# Altium schematic sheet LPCB234 - BMS INTERFACE.SchDoc
size A3; Address1: Factory 10; Address2: 9-13 Dingley Avenue, Dandeong, VICTORIA 3175, AUSTRALIA; DocumentNumber: 4; Revision: 1; SheetNumber: 4; SheetTotal: 10; Lockie__PCB_SUB_ASSEMBLY: BMS Interface; Lockie__PCB_ASSEMBLY: Main; Lockie__LDL: LPCB234; Lockie__PCB_DESCRIPTION: RM4 Power Node
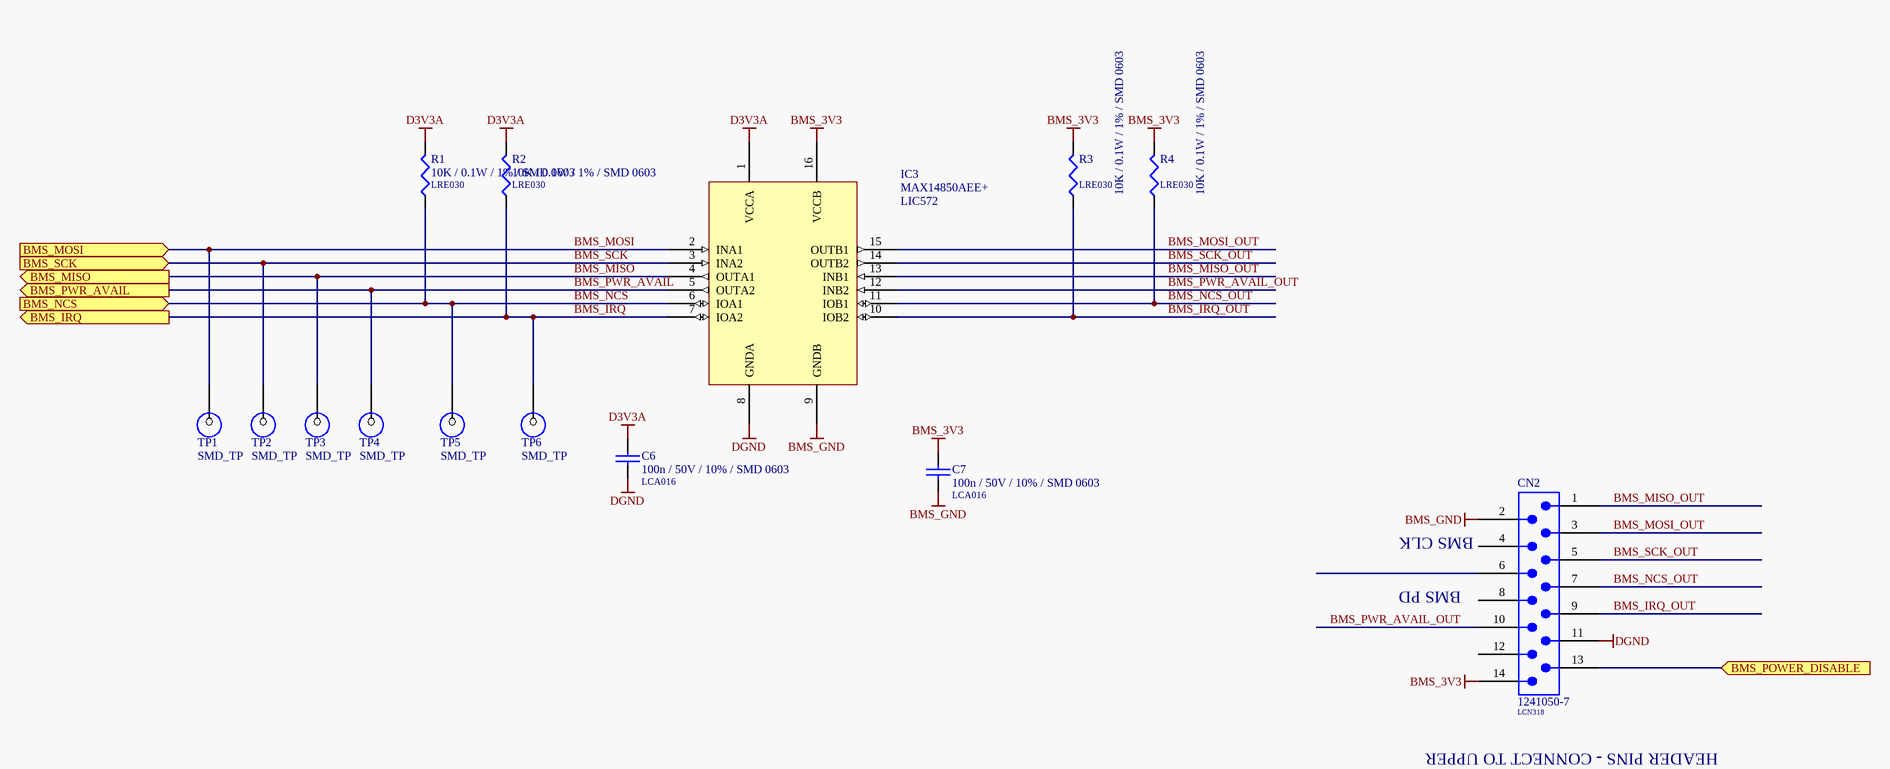
[diagram p0: LPCB234 - BMS INTERFACE.SchDoc]

## Parts
C6  100n / 50V / 10% / SMD 0603  LDL_NUMBER: LCA016  [LFP011__CC1608-0603-IPC7351_B]
C7  100n / 50V / 10% / SMD 0603  LDL_NUMBER: LCA016  [LFP011__CC1608-0603-IPC7351_B]
CN2  1241050-7  LDL_NUMBER: LCN318  [1241050-7]
IC3  MAX14850AEE+  LDL_NUMBER: LIC572  [LFP137__PW016]
R1  10K / 0.1W / 1% / SMD 0603  LDL_NUMBER: LRE030  [LFP020__CR1608-0603-IPC7351_B]
R2  10K / 0.1W / 1% / SMD 0603  LDL_NUMBER: LRE030  [LFP020__CR1608-0603-IPC7351_B]
R3  10K / 0.1W / 1% / SMD 0603  LDL_NUMBER: LRE030  [LFP020__CR1608-0603-IPC7351_B]
R4  10K / 0.1W / 1% / SMD 0603  LDL_NUMBER: LRE030  [LFP020__CR1608-0603-IPC7351_B]
TP1  SMD_TP  [SMD-TP]  (no BOM)
TP2  SMD_TP  [SMD-TP]  (no BOM)
TP3  SMD_TP  [SMD-TP]  (no BOM)
TP4  SMD_TP  [SMD-TP]  (no BOM)
TP5  SMD_TP  [SMD-TP]  (no BOM)
TP6  SMD_TP  [SMD-TP]  (no BOM)

## Ports
BMS_IRQ (out), BMS_MISO (out), BMS_MOSI (in), BMS_NCS (in), BMS_POWER_DISABLE (in), BMS_PWR_AVAIL (out), BMS_SCK (in)

## Nets
BMS_3V3: C7.1 CN2.14 IC3.16(VCCB) R3.2 R4.2
BMS_GND: C7.2 CN2.2 IC3.9(GNDB)
D3V3A: C6.1 IC3.1(VCCA) R1.2 R2.2
DGND: C6.2 CN2.11 IC3.8(GNDA)
BMS_IRQ: IC3.7(IOA2) R2.1 TP6.1 ; port BMS_IRQ
BMS_IRQ_OUT: CN2.9 IC3.10(IOB2) R3.1
BMS_MISO: IC3.4(OUTA1) TP3.1 ; port BMS_MISO
BMS_MISO_OUT: CN2.1 IC3.13(INB1)
BMS_MOSI: IC3.2(INA1) TP1.1 ; port BMS_MOSI
BMS_MOSI_OUT: CN2.3 IC3.15(OUTB1)
BMS_NCS: IC3.6(IOA1) R1.1 TP5.1 ; port BMS_NCS
BMS_NCS_OUT: CN2.7 IC3.11(IOB1) R4.1
BMS_POWER_DISABLE: CN2.13 ; port BMS_POWER_DISABLE
BMS_PWR_AVAIL: IC3.5(OUTA2) TP4.1 ; port BMS_PWR_AVAIL
BMS_PWR_AVAIL_OUT: CN2.10 IC3.12(INB2)
BMS_SCK: IC3.3(INA2) TP2.1 ; port BMS_SCK
BMS_SCK_OUT: CN2.5 IC3.14(OUTB2)

Not connected (* = marked no-connect by the designer): CN2 4 6 8 12

## Notes on the sheet
- BMS CLK
- BMS PD
- HEADER PINS - CONNECT TO UPPER
- PCB COMPONENT DESCRIPTION
- LDL NUMBER
- Assembly Details
- Size
- Drawing File Name
- Revision
- http://rloop.org
- Scale
- A3
- Sheet Details
- N.T.S
- Sheet:
- Of:

## Library data of the parts
C6 C7 = 100n / 50V / 10% / SMD 0603: Capacitor, Ceramic Chip, 100nF (0.1uF), 50V, 5%, SMD 0603 [LCA016]; FMEDA__OPERATING__VOLTAGE_MIN: 0; FMEDA__OPERATING__VOLTAGE_MAX: 3.3; FMEDA__OPERATING__TEMP_MIN: -20; FMEDA__OPERATING__TEMP_TYP: 27; FMEDA__OPERATING__TEMP_MAX: 50; FMEDA__CHANNEL: COM; Value: 100n; FMEDA__FUNCTION_IN_SYSTEM: *; FMEDA__OPERATING__VOLTAGE_TYP: 3.3
CN2 = 1241050-7: Connector, Header, 2.54mm, 7 Pins x 2 Rows, SMD; FMEDA__CHANNEL: COM; FMEDA__OPERATING__CURRENT_MAX: 0; FMEDA__OPERATING__TEMP_MAX: 50; FMEDA__OPERATING__TEMP_MIN: -20; FMEDA__OPERATING__TEMP_TYP: 27; FMEDA__OPERATING__VOLTAGE_MAX: 16; FMEDA__OPERATING__VOLTAGE_TYP: 12; FMEDA__FUNCTION_IN_SYSTEM: *; FMEDA__OPERATING__CURRENT_MIN: 0; FMEDA__OPERATING__CURRENT_TYP: 0; FMEDA__OPERATING__VOLTAGE_MIN: 0
IC3 = MAX14850AEE+: IC, 6 Channel Digital Isolator, SMD [LIC572]
R1-R4 = 10K / 0.1W / 1% / SMD 0603: Resistor, Ceramic Chip, 10K, 0.1W, 1%, SMD 0603 [LRE030]; FMEDA__OPERATING__POWER_MAX: 0; FMEDA__OPERATING__TEMP_MAX: 50; FMEDA__OPERATING__TEMP_MIN: -20; FMEDA__OPERATING__TEMP_TYP: 27; FMEDA__CHANNEL: COM; Value: 10K; FMEDA__OPERATING__POWER_MIN: 0; FMEDA__OPERATING__VOLTAGE_MAX: 0; FMEDA__OPERATING__VOLTAGE_MIN: 0; FMEDA__OPERATING__VOLTAGE_TYP: 0; FMEDA__FUNCTION_IN_SYSTEM: *
TP1-TP6 = SMD_TP: SMD Test Point; FMEDA__CHANNEL: COM; FMEDA__OPERATING__CURRENT_MAX: 0; FMEDA__OPERATING__TEMP_MAX: 50; FMEDA__OPERATING__TEMP_MIN: -20; FMEDA__OPERATING__TEMP_TYP: 27; FMEDA__OPERATING__VOLTAGE_MAX: 16; FMEDA__OPERATING__VOLTAGE_TYP: 12; FMEDA__OPERATING__CURRENT_MIN: 0; FMEDA__OPERATING__CURRENT_TYP: 0; FMEDA__OPERATING__VOLTAGE_MIN: 0